# Altium schematic sheet Thermocouple to Digital Converter.SchDoc
size A; SheetNumber: 5; SheetTotal: 19
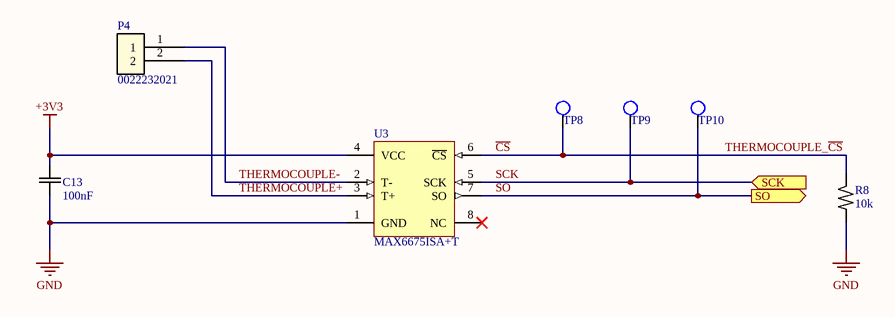
[diagram p0: Thermocouple to Digital Converter.SchDoc]

## Parts
C13  100nF  [C0603]
P4  0022232021  [Signal2]
R8  10k  [R0603]
TP8  TestPoint  [TESTPOINT_SMD_1.27MM]  (value not drawn)  (no BOM)
TP9  TestPoint  [TESTPOINT_SMD_1.27MM]  (value not drawn)  (no BOM)
TP10  TestPoint  [TESTPOINT_SMD_1.27MM]  (value not drawn)  (no BOM)
U3  MAX6675ISA+T  [SOIC-8]

## Ports
SCK (in), SO (out)

## Nets
+3V3: C13.2 U3.4(VCC)
GND: C13.1 R8.1 U3.1(GND)
~{CS}: R8.2 TP8.1 U3.6(~{CS})  [also labelled THERMOCOUPLE_~{CS}]
SCK: TP9.1 U3.5(SCK) ; port SCK
SO: TP10.1 U3.7(SO) ; port SO
THERMOCOUPLE+: P4.2 U3.3(T+)
THERMOCOUPLE-: P4.1 U3.2(T-)

Not connected (* = marked no-connect by the designer): U3 8(NC)*

## Notes on the sheet
- Project:
- Sheet Title:
- Size
- Date:
- A
- Sheet Number:
- Sheet Total:
- Revision:
- Time:
- Author:

## Library data of the parts
C13 = Cap_cer: CAP CER 100nF 50V X7R 0603; MF: HRE; MP: CGA0603X7R104K500JT; ComponentLink1Description: Datasheet; ComponentLink1URL: https://www.lcsc.com/datasheet/C6119867.pdf; ComponentLink2Description: Supplier1; ComponentLink2URL: https://www.lcsc.com/product-detail/C6119867.html
P4 = Signal2: SignalConnector, 2 leads; MF: Molex; ComponentLink1Description: Datasheet; ComponentLink1URL: https://www.molex.com/content/dam/molex/molex-dot-com/products/automated/en-us/salesdrawingpdf/637/6373/022232021_sd.pdf?inline; ComponentLink2Description: Supplier1; ComponentLink2URL: https://www.digikey.com/en/products/detail/molex/0022232021/26667; MP: 0022232021
R8 = Res: RES 10kΩ ±1% 100mW 0603; MF: FOJAN; MP: FRC0603F1002TS; ComponentLink1Description: Datasheet; ComponentLink1URL: https://www.lcsc.com/datasheet/C2906982.pdf; ComponentLink2Description: Supplier1; ComponentLink2URL: https://www.lcsc.com/product-detail/C2906982.html
U3 = MAX6675ISA+T: Cold-Junction-Compensated K-Thermocouple-to-Digital Converter; MF: MAXIM; ComponentLink1Description: Datasheet; ComponentLink1URL: https://www.lcsc.com/datasheet/C16030.pdf; ComponentLink2Description: Supplier1; ComponentLink2URL: https://www.lcsc.com/product-detail/C16030.html?s_z=n_MAX6675; MP: MAX6675ISA+T